# EasyEDA Pro project PixelGrid_Controller.eprj, schematic PixelGrid_Controller_v2
Board Name: PixelGrid_Controller_v2; Create Date: 2024-11-10; Page Name: Sheet_1; Project Name: PixelGrid_Controller; Schematic Name: PixelGrid_Controller_v2; Update Date: 2024-11-10; Add into BOM: yes; Company: Your Company; Convert to PCB: yes; Date: 2024-03-17; Draw By: Rimvydas Lazdauskas; REV: 1.0; Sheet: 1/1
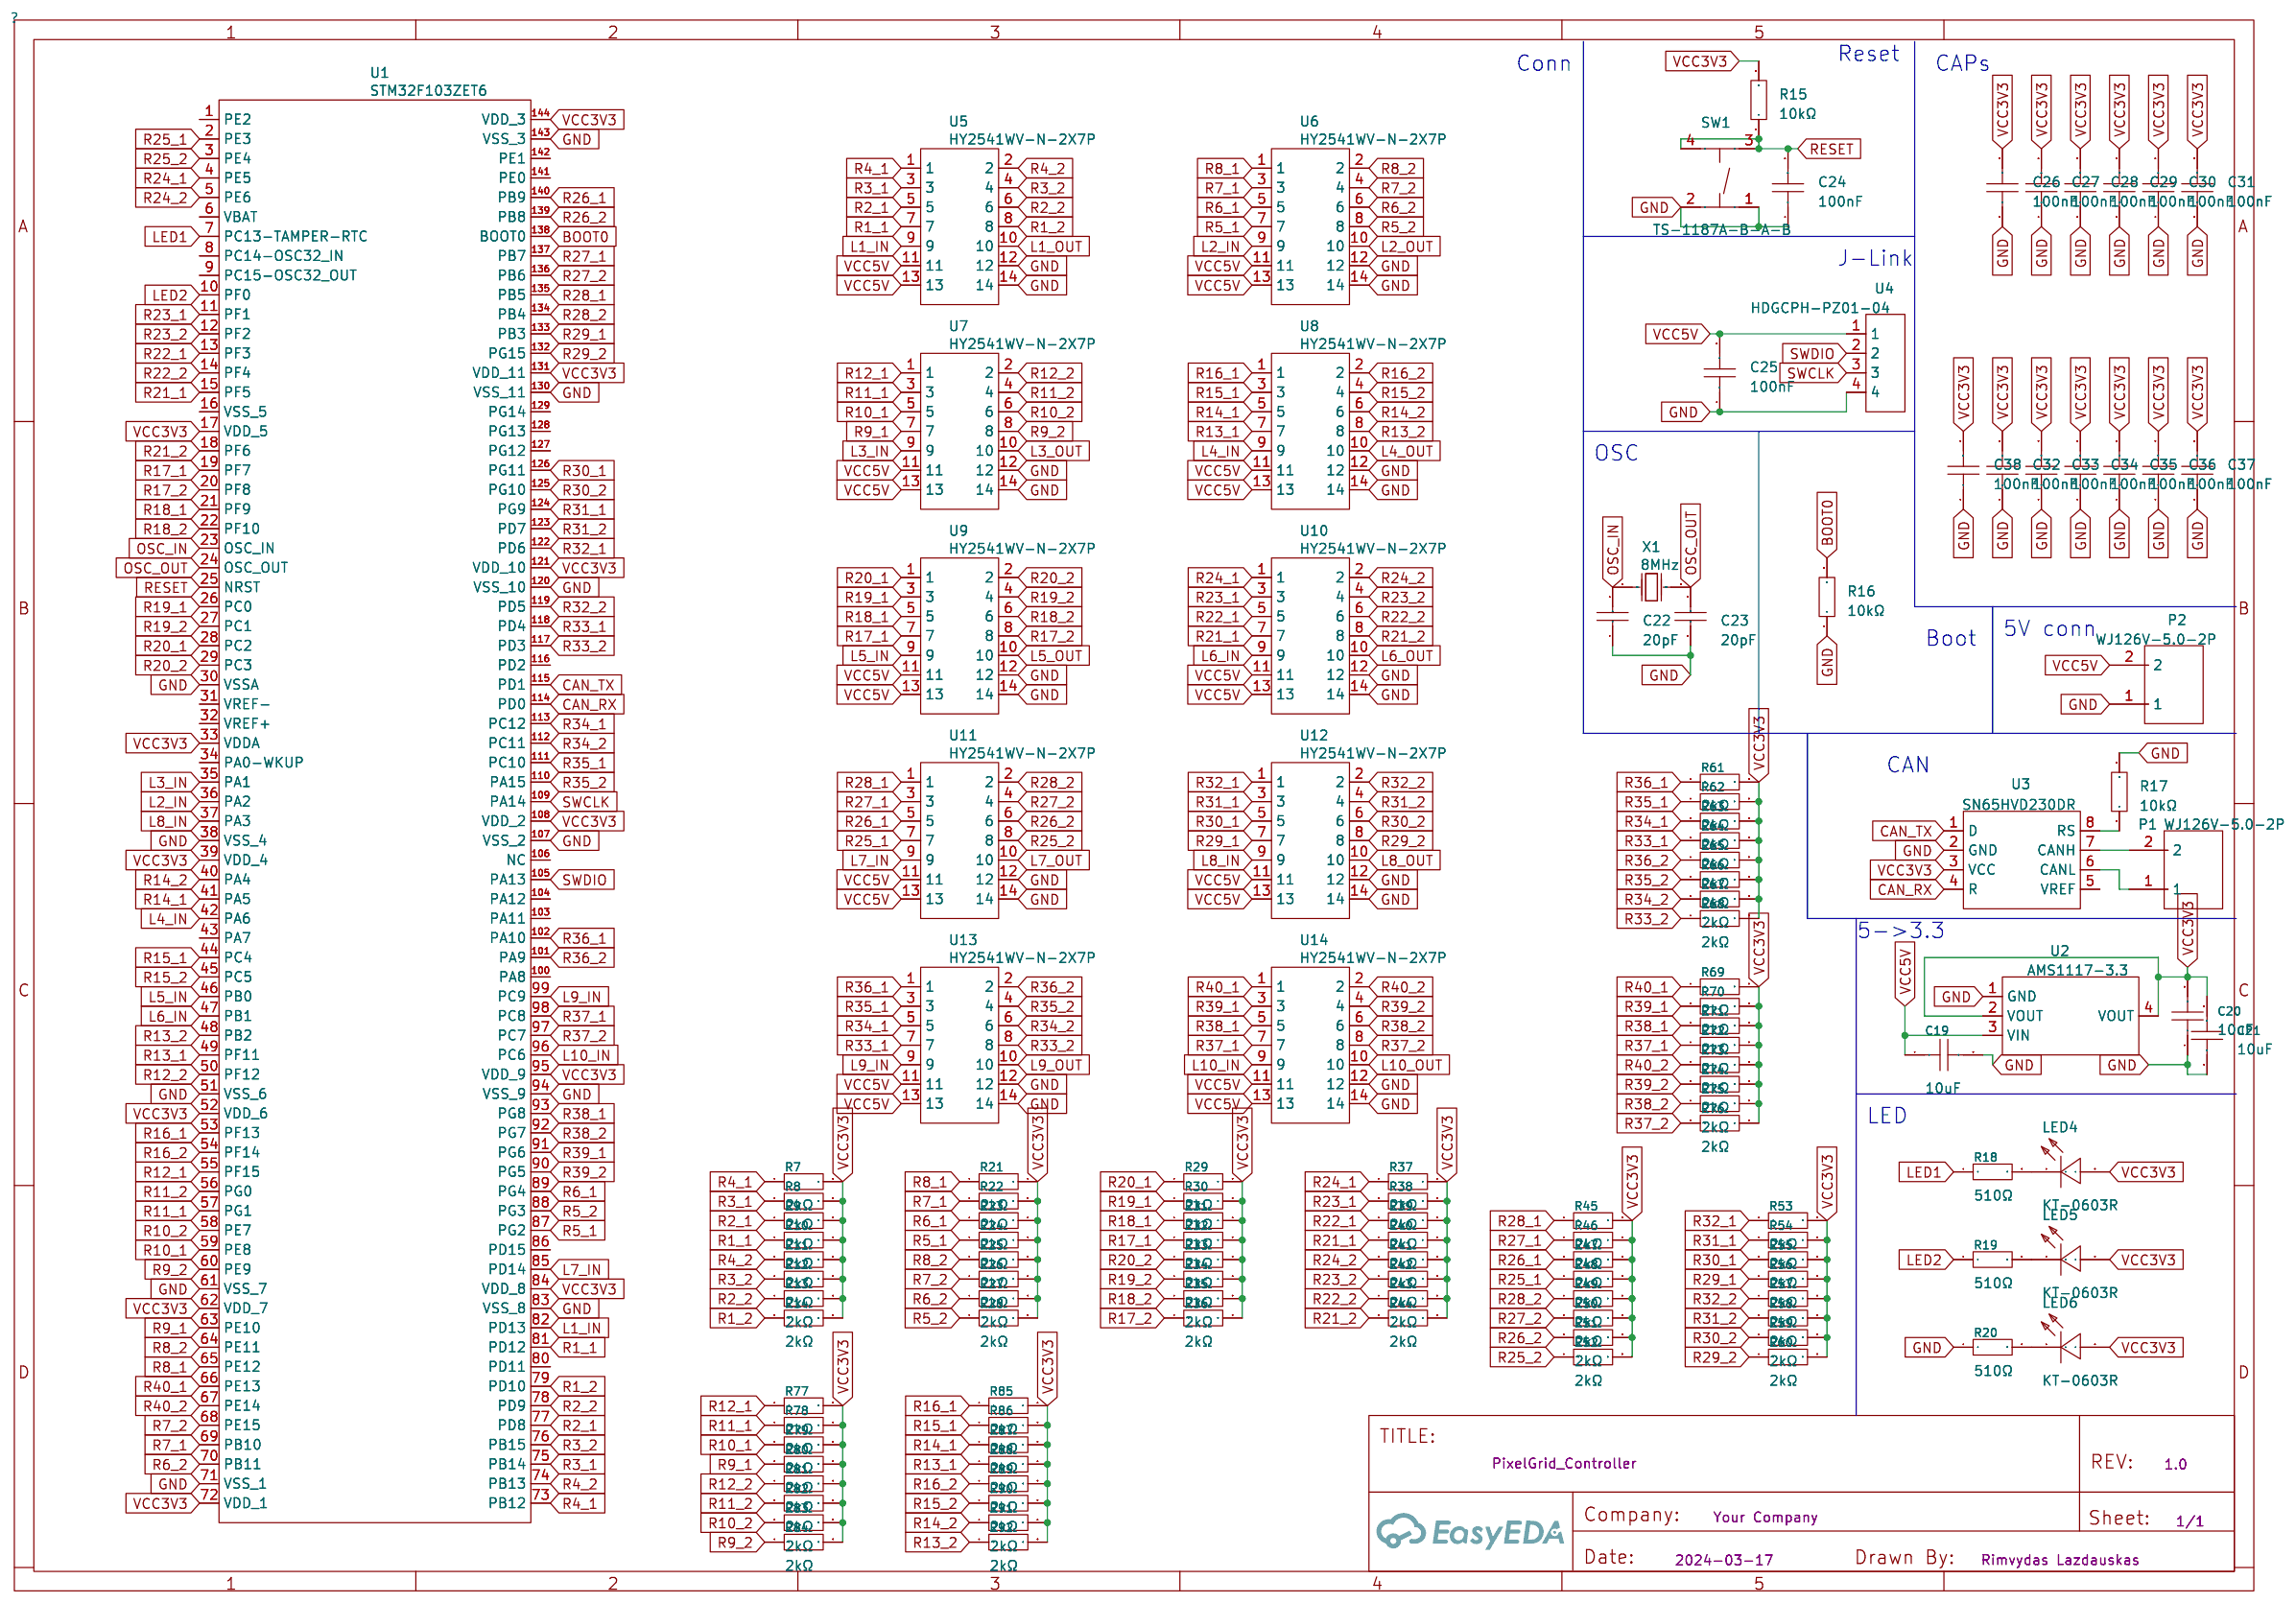
[diagram p0: schematic sheet]

## Parts
C19  10uF  [C0603]
C20  10uF  [C0603]
C21  10uF  [C0603]
C22  20pF  [C0402]
C23  20pF  [C0402]
C24  100nF  [C0402]
C25  100nF  [C0402]
C26  100nF  [C0402]
C27  100nF  [C0402]
C28  100nF  [C0402]
C29  100nF  [C0402]
C30  100nF  [C0402]
C31  100nF  [C0402]
C32  100nF  [C0402]
C33  100nF  [C0402]
C34  100nF  [C0402]
C35  100nF  [C0402]
C36  100nF  [C0402]
C37  100nF  [C0402]
C38  100nF  [C0402]
LED4  KT-0603R  [LED0603-RD]
LED5  KT-0603R  [LED0603-RD]
LED6  KT-0603R  [LED0603-RD]
P1  WJ126V-5.0-2P  [CONN-TH_WJ126V-5.0-2P]
P2  WJ126V-5.0-2P  [CONN-TH_WJ126V-5.0-2P]
R7  2kΩ  [R0402]
R8  2kΩ  [R0402]
R9  2kΩ  [R0402]
R10  2kΩ  [R0402]
R11  2kΩ  [R0402]
R12  2kΩ  [R0402]
R13  2kΩ  [R0402]
R14  2kΩ  [R0402]
R15  10kΩ  [R0402]
R16  10kΩ  [R0402]
R17  10kΩ  [R0402]
R18  510Ω  [R0402]
R19  510Ω  [R0402]
R20  510Ω  [R0402]
R21  2kΩ  [R0402]
R22  2kΩ  [R0402]
R23  2kΩ  [R0402]
R24  2kΩ  [R0402]
R25  2kΩ  [R0402]
R26  2kΩ  [R0402]
R27  2kΩ  [R0402]
R28  2kΩ  [R0402]
R29  2kΩ  [R0402]
R30  2kΩ  [R0402]
R31  2kΩ  [R0402]
R32  2kΩ  [R0402]
R33  2kΩ  [R0402]
R34  2kΩ  [R0402]
R35  2kΩ  [R0402]
R36  2kΩ  [R0402]
R37  2kΩ  [R0402]
R38  2kΩ  [R0402]
R39  2kΩ  [R0402]
R40  2kΩ  [R0402]
R41  2kΩ  [R0402]
R42  2kΩ  [R0402]
R43  2kΩ  [R0402]
R44  2kΩ  [R0402]
R45  2kΩ  [R0402]
R46  2kΩ  [R0402]
R47  2kΩ  [R0402]
R48  2kΩ  [R0402]
R49  2kΩ  [R0402]
R50  2kΩ  [R0402]
R51  2kΩ  [R0402]
R52  2kΩ  [R0402]
R53  2kΩ  [R0402]
R54  2kΩ  [R0402]
R55  2kΩ  [R0402]
R56  2kΩ  [R0402]
R57  2kΩ  [R0402]
R58  2kΩ  [R0402]
R59  2kΩ  [R0402]
R60  2kΩ  [R0402]
R61  2kΩ  [R0402]
R62  2kΩ  [R0402]
R63  2kΩ  [R0402]
R64  2kΩ  [R0402]
R65  2kΩ  [R0402]
R66  2kΩ  [R0402]
R67  2kΩ  [R0402]
R68  2kΩ  [R0402]
R69  2kΩ  [R0402]
R70  2kΩ  [R0402]
R71  2kΩ  [R0402]
R72  2kΩ  [R0402]
R73  2kΩ  [R0402]
R74  2kΩ  [R0402]
R75  2kΩ  [R0402]
R76  2kΩ  [R0402]
R77  2kΩ  [R0402]
R78  2kΩ  [R0402]
R79  2kΩ  [R0402]
R80  2kΩ  [R0402]
R81  2kΩ  [R0402]
R82  2kΩ  [R0402]
R83  2kΩ  [R0402]
R84  2kΩ  [R0402]
R85  2kΩ  [R0402]
R86  2kΩ  [R0402]
R87  2kΩ  [R0402]
R88  2kΩ  [R0402]
R89  2kΩ  [R0402]
R90  2kΩ  [R0402]
R91  2kΩ  [R0402]
R92  2kΩ  [R0402]
SW1  TS-1187A-B-A-B  [SW-SMD_4P-L5.1-W5.1-P3.70-LS6.5-TL-2]
U1  STM32F103ZET6  [LQFP-144_L20.0-W20.0-P0.50-LS22.0-BL]
U2  AMS1117-3.3  [SOT-223-3_L6.5-W3.4-P2.30-LS7.0-BR]
U3  SN65HVD230DR  [SOIC-8_L4.9-W3.9-P1.27-LS6.0-BL]
U4  HDGCPH-PZ01-04  [HDR-TH_4P-P2.54-V-M_1]  (no BOM)
U5  HY2541WV-N-2X7P  [HDR-TH_14P-P2.54-V-F-R2-C7-S2.54-2]
U6  HY2541WV-N-2X7P  [HDR-TH_14P-P2.54-V-F-R2-C7-S2.54-2]
U7  HY2541WV-N-2X7P  [HDR-TH_14P-P2.54-V-F-R2-C7-S2.54-2]
U8  HY2541WV-N-2X7P  [HDR-TH_14P-P2.54-V-F-R2-C7-S2.54-2]
U9  HY2541WV-N-2X7P  [HDR-TH_14P-P2.54-V-F-R2-C7-S2.54-2]
U10  HY2541WV-N-2X7P  [HDR-TH_14P-P2.54-V-F-R2-C7-S2.54-2]
U11  HY2541WV-N-2X7P  [HDR-TH_14P-P2.54-V-F-R2-C7-S2.54-2]
U12  HY2541WV-N-2X7P  [HDR-TH_14P-P2.54-V-F-R2-C7-S2.54-2]
U13  HY2541WV-N-2X7P  [HDR-TH_14P-P2.54-V-F-R2-C7-S2.54-2]
U14  HY2541WV-N-2X7P  [HDR-TH_14P-P2.54-V-F-R2-C7-S2.54-2]
X1  8MHz  [CRYSTAL-SMD_L5.0-W3.2]

## Library data of the parts
C19-C21 = CL10A106KP8NNNC: Capacitance: Tolerance:±10% Tolerance:±10% Voltage Rated: Temperature Coefficient:; LCSC Part Name: 10uF ±10% 10V; Supplier Part: C19702; Manufacturer: SAMSUNG(三星); Supplier Footprint: 0603; JLCPCB Part Class: Basic Part; Datasheet: https://atta.szlcsc.com/upload/public/pdf/source/20160218/1457707763339.pdf; Supplier: LCSC; Tolerance: ±10%
C22 C23 = 0402CG200J500NT: Capacitance: Tolerance:±5% Tolerance:±5% Voltage Rated: Temperature Coefficient:; LCSC Part Name: 20pF ±5% 50V; Supplier Part: C1554; Manufacturer: FH(风华); Supplier Footprint: 0402; JLCPCB Part Class: Basic Part; Datasheet: https://atta.szlcsc.com/upload/public/pdf/source/20200305/C486355_26A10D38EF8C2A5C37091D0039909270.pdf; Supplier: LCSC; Tolerance: ±5%
C24-C38 = CL05B104KO5NNNC: Capacitance: Tolerance:±10% Tolerance:±10% Voltage Rated: Temperature Coefficient:; LCSC Part Name: 100nF ±10% 16V; Supplier Part: C1525; Manufacturer: SAMSUNG(三星); Supplier Footprint: 0402; JLCPCB Part Class: Basic Part; Datasheet: https://atta.szlcsc.com/upload/public/pdf/source/20160218/1457707763339.pdf; Supplier: LCSC; Tolerance: ±10%
LED4-LED6 = KT-0603R: Emitted Color:Red Power Dissipation:- Forward Current:- Dominant Wavelength:- Dominant Wavelength:- Peak Wavelength:- Diode Configuration:- Lens Color:- Color Temperature:- Color Temperature:- Viewing Angle:- Mounting Sytle:- Operating Temperature:-40℃~+8; LCSC Part Name: 0603 红灯 高亮; Supplier Part: C2286; Manufacturer: KENTO; Supplier Footprint: 0603; JLCPCB Part Class: Basic Part; Datasheet: https://atta.szlcsc.com/upload/public/pdf/source/20160616/1466072038404.pdf; Supplier: LCSC; Emitted Color: Red; Operating Temperature: -40℃~+85℃
P1 P2 = WJ126V-5.0-2P: Supplier: LCSC; Manufacturer: KANGNEX(康奈克斯电气); Supplier Part: C8404; JLCPCB Part Class: Extended Part
R7-R14 R21-R92 = 0402WGF2001TCE: Type:Thick Film Resistors Resistance:2kΩ Tolerance:±1% Tolerance:±1% Power(Watts): Overload Voltage (Max): Temperature Coefficient:±100ppm/℃ Temperature Coefficient:±100ppm/℃ Operating Temperature Range:-55℃~+155℃ Operating Temperature Range:-55℃~+155℃; LCSC Part Name: 2kΩ ±1% 62.5mW 厚膜电阻; Supplier Part: C4109; Manufacturer: UNI-ROYAL(厚声); Supplier Footprint: 0402; JLCPCB Part Class: Basic Part; Datasheet: https://atta.szlcsc.com/upload/public/pdf/source/20200306/C422600_1E6D84923E4A46A82E41ADD87F860B5C.pdf; Supplier: LCSC; Type: Thick Film Resistors; Tolerance: ±1%; Temperature Coefficient: ±100ppm/℃; Operating Temperature Range: -55℃~+155℃
R15-R17 = 0402WGF1002TCE: Type:Thick Film Resistors Resistance:10kΩ Tolerance:±1% Tolerance:±1% Power(Watts): Overload Voltage (Max): Temperature Coefficient:±100ppm/℃ Temperature Coefficient:±100ppm/℃ Operating Temperature Range:-55℃~+155℃ Operating Temperature Range:-55℃~+155℃; LCSC Part Name: 10kΩ ±1% 62.5mW 厚膜电阻; Supplier Part: C25744; Manufacturer: UNI-ROYAL(厚声); Supplier Footprint: 0402; JLCPCB Part Class: Basic Part; Datasheet: https://atta.szlcsc.com/upload/public/pdf/source/20200306/C422600_1E6D84923E4A46A82E41ADD87F860B5C.pdf; Supplier: LCSC; Type: Thick Film Resistors; Tolerance: ±1%; Temperature Coefficient: ±100ppm/℃; Operating Temperature Range: -55℃~+155℃
R18-R20 = 0402WGF5100TCE: Type:Thick Film Resistors Resistance: Tolerance:±1% Tolerance:±1% Power(Watts): Overload Voltage (Max): Temperature Coefficient:±100ppm/℃ Temperature Coefficient:±100ppm/℃ Operating Temperature Range:-55℃~+155℃ Operating Temperature Range:-55℃~+155℃; LCSC Part Name: 510Ω ±1% 62.5mW 厚膜电阻; Supplier Part: C25123; Manufacturer: UNI-ROYAL(厚声); Supplier Footprint: 0402; JLCPCB Part Class: Basic Part; Datasheet: https://atta.szlcsc.com/upload/public/pdf/source/20200306/C422600_1E6D84923E4A46A82E41ADD87F860B5C.pdf; Supplier: LCSC; Type: Thick Film Resistors; Tolerance: ±1%; Temperature Coefficient: ±100ppm/℃; Operating Temperature Range: -55℃~+155℃
SW1 = TS-1187A-B-A-B: Supplier: LCSC; Supplier Part: C318884; Manufacturer: XKB Connectivity(中国星坤); JLCPCB Part Class: Basic Part
U1 = STM32F103ZET6: tags: STM32; Supplier Part: C8287; Supplier: LCSC; Manufacturer: ST(意法半导体); JLCPCB Part Class: Extended Part
U2 = AMS1117-3.3: Supplier: LCSC; Manufacturer: AMS; Supplier Part: C6186; JLCPCB Part Class: Basic Part
U3 = SN65HVD230DR: Supplier: LCSC; Manufacturer: TI(德州仪器); Supplier Part: C12084; JLCPCB Part Class: Extended Part
U4 = HDGCPH-PZ01-04: Supplier: LCSC; Supplier Part: C19190970; Manufacturer: HDGC(华德共创)
U5-U14 = HY2541WV-N-2X7P: Supplier: LCSC; Supplier Part: C17179454; Manufacturer: HanElectricity(瀚源); Manufacturer Part: HY2541WV-N-2x7P; JLCPCB Part Class: Extended Part
X1 = 8MHz: Supplier: LCSC; Manufacturer: YXC(扬兴晶振); Manufacturer Part: X50328MSB2GI; Supplier Part: C115962; JLCPCB Part Class: Basic Part

## Nets
GND: C19.2 C20.1 C21.1 C22.1 C23.1 C24.1 C25.1 C26.1 C27.1 C28.1 C29.1 C30.1 C31.1 C32.1 C33.1 C34.1 C35.1 C36.1 C37.1 C38.1 P2.1 R16.1 R17.2 R20.1 SW1.1(A) SW1.2(B) U1.30(VSSA) U1.38(VSS_4) U1.51(VSS_6) U1.61(VSS_7) U1.71(VSS_1) U1.83(VSS_8) U1.94(VSS_9) U1.107(VSS_2) U1.120(VSS_10) U1.130(VSS_11) U1.143(VSS_3) U2.1(GND) U3.2(GND) U4.4 U5.12 U5.14 U6.12 U6.14 U7.12 U7.14 U8.12 U8.14 U9.12 U9.14 U10.12 U10.14 U11.12 U11.14 U12.12 U12.14 U13.12 U13.14 U14.12 U14.14
VCC3V3: C20.2 C21.2 C26.2 C27.2 C28.2 C29.2 C30.2 C31.2 C32.2 C33.2 C34.2 C35.2 C36.2 C37.2 C38.2 LED4.2(A) LED5.2(A) LED6.2(A) R7.2 R8.2 R9.2 R10.2 R11.2 R12.2 R13.2 R14.2 R15.2 R21.2 R22.2 R23.2 R24.2 R25.2 R26.2 R27.2 R28.2 R29.2 R30.2 R31.2 R32.2 R33.2 R34.2 R35.2 R36.2 R37.2 R38.2 R39.2 R40.2 R41.2 R42.2 R43.2 R44.2 R45.2 R46.2 R47.2 R48.2 R49.2 R50.2 R51.2 R52.2 R53.2 R54.2 R55.2 R56.2 R57.2 R58.2 R59.2 R60.2 R61.2 R62.2 R63.2 R64.2 R65.2 R66.2 R67.2 R68.2 R69.2 R70.2 R71.2 R72.2 R73.2 R74.2 R75.2 R76.2 R77.2 R78.2 R79.2 R80.2 R81.2 R82.2 R83.2 R84.2 R85.2 R86.2 R87.2 R88.2 R89.2 R90.2 R91.2 R92.2 U1.17(VDD_5) U1.33(VDDA) U1.39(VDD_4) U1.52(VDD_6) U1.62(VDD_7) U1.72(VDD_1) U1.84(VDD_8) U1.95(VDD_9) U1.108(VDD_2) U1.121(VDD_10) U1.131(VDD_11) U1.144(VDD_3) U2.2(VOUT) U2.4(VOUT) U3.3(VCC)
VCC5V: C19.1 C25.2 P2.2 U2.3(VIN) U4.1 U5.11 U5.13 U6.11 U6.13 U7.11 U7.13 U8.11 U8.13 U9.11 U9.13 U10.11 U10.13 U11.11 U11.13 U12.11 U12.13 U13.11 U13.13 U14.11 U14.13
BOOT0: R16.2 U1.138(BOOT0)
CAN_RX: U1.114(PD0) U3.4(R)
CAN_TX: U1.115(PD1) U3.1(D)
L1_IN: U1.82(PD13) U5.9
L1_OUT: U5.10
L2_IN: U1.36(PA2) U6.9
L2_OUT: U6.10
L3_IN: U1.35(PA1) U7.9
L3_OUT: U7.10
L4_IN: U1.42(PA6) U8.9
L4_OUT: U8.10
L5_IN: U1.46(PB0) U9.9
L5_OUT: U9.10
L6_IN: U1.47(PB1) U10.9
L6_OUT: U10.10
L7_IN: U1.85(PD14) U11.9
L7_OUT: U11.10
L8_IN: U1.37(PA3) U12.9
L8_OUT: U12.10
L9_IN: U1.99(PC9) U13.9
L9_OUT: U13.10
L10_IN: U1.96(PC6) U14.9
L10_OUT: U14.10
LED1: R18.1 U1.7(PC13-TAMPER-RTC)
LED2: R19.1 U1.10(PF0)
OSC_IN: C22.2 U1.23(OSC_IN) X1.1(OSC1)
OSC_OUT: C23.2 U1.24(OSC_OUT) X1.2(OSC2)
R1_1: R10.1 U1.81(PD12) U5.7
R1_2: R14.1 U1.79(PD10) U5.8
R2_1: R9.1 U1.77(PD8) U5.5
R2_2: R13.1 U1.78(PD9) U5.6
R3_1: R8.1 U1.75(PB14) U5.3
R3_2: R12.1 U1.76(PB15) U5.4
R4_1: R7.1 U1.73(PB12) U5.1
R4_2: R11.1 U1.74(PB13) U5.2
R5_1: R24.1 U1.87(PG2) U6.7
R5_2: R28.1 U1.88(PG3) U6.8
R6_1: R23.1 U1.89(PG4) U6.5
R6_2: R27.1 U1.70(PB11) U6.6
R7_1: R22.1 U1.69(PB10) U6.3
R7_2: R26.1 U1.68(PE15) U6.4
R8_1: R21.1 U1.65(PE12) U6.1
R8_2: R25.1 U1.64(PE11) U6.2
R9_1: R80.1 U1.63(PE10) U7.7
R9_2: R84.1 U1.60(PE9) U7.8
R10_1: R79.1 U1.59(PE8) U7.5
R10_2: R83.1 U1.58(PE7) U7.6
R11_1: R78.1 U1.57(PG1) U7.3
R11_2: R82.1 U1.56(PG0) U7.4
R12_1: R77.1 U1.55(PF15) U7.1
R12_2: R81.1 U1.50(PF12) U7.2
R13_1: R88.1 U1.49(PF11) U8.7
R13_2: R92.1 U1.48(PB2) U8.8
R14_1: R87.1 U1.41(PA5) U8.5
R14_2: R91.1 U1.40(PA4) U8.6
R15_1: R86.1 U1.44(PC4) U8.3
R15_2: R90.1 U1.45(PC5) U8.4
R16_1: R85.1 U1.53(PF13) U8.1
R16_2: R89.1 U1.54(PF14) U8.2
R17_1: R32.1 U1.19(PF7) U9.7
R17_2: R36.1 U1.20(PF8) U9.8
R18_1: R31.1 U1.21(PF9) U9.5
R18_2: R35.1 U1.22(PF10) U9.6
R19_1: R30.1 U1.26(PC0) U9.3
R19_2: R34.1 U1.27(PC1) U9.4
R20_1: R29.1 U1.28(PC2) U9.1
R20_2: R33.1 U1.29(PC3) U9.2
R21_1: R40.1 U1.15(PF5) U10.7
R21_2: R44.1 U1.18(PF6) U10.8
R22_1: R39.1 U1.13(PF3) U10.5
R22_2: R43.1 U1.14(PF4) U10.6
R23_1: R38.1 U1.11(PF1) U10.3
R23_2: R42.1 U1.12(PF2) U10.4
R24_1: R37.1 U1.4(PE5) U10.1
R24_2: R41.1 U1.5(PE6) U10.2
R25_1: R48.1 U1.2(PE3) U11.7
R25_2: R52.1 U1.3(PE4) U11.8
R26_1: R47.1 U1.140(PB9) U11.5
R26_2: R51.1 U1.139(PB8) U11.6
R27_1: R46.1 U1.137(PB7) U11.3
R27_2: R50.1 U1.136(PB6) U11.4
R28_1: R45.1 U1.135(PB5) U11.1
R28_2: R49.1 U1.134(PB4) U11.2
R29_1: R56.1 U1.133(PB3) U12.7
R29_2: R60.1 U1.132(PG15) U12.8
R30_1: R55.1 U1.126(PG11) U12.5
R30_2: R59.1 U1.125(PG10) U12.6
R31_1: R54.1 U1.124(PG9) U12.3
R31_2: R58.1 U1.123(PD7) U12.4
R32_1: R53.1 U1.122(PD6) U12.1
R32_2: R57.1 U1.119(PD5) U12.2
R33_1: R64.1 U1.118(PD4) U13.7
R33_2: R68.1 U1.117(PD3) U13.8
R34_1: R63.1 U1.113(PC12) U13.5
R34_2: R67.1 U1.112(PC11) U13.6
R35_1: R62.1 U1.111(PC10) U13.3
R35_2: R66.1 U1.110(PA15) U13.4
R36_1: R61.1 U1.102(PA10) U13.1
R36_2: R65.1 U1.101(PA9) U13.2
R37_1: R72.1 U1.98(PC8) U14.7
R37_2: R76.1 U1.97(PC7) U14.8
R38_1: R71.1 U1.93(PG8) U14.5
R38_2: R75.1 U1.92(PG7) U14.6
R39_1: R70.1 U1.91(PG6) U14.3
R39_2: R74.1 U1.90(PG5) U14.4
R40_1: R69.1 U1.66(PE13) U14.1
R40_2: R73.1 U1.67(PE14) U14.2
RESET: C24.2 R15.1 SW1.3(C) SW1.4(D) U1.25(NRST)
SWCLK: U1.109(PA14) U4.3
SWDIO: U1.105(PA13) U4.2
$2N2: R17.1 U3.8(RS)
$2N4: P1.2 U3.7(CANH)
$2N5: P1.1 U3.6(CANL)
$2N12387: LED4.1(K) R18.2
$2N12392: LED5.1(K) R19.2
$2N12397: LED6.1(K) R20.2

Not connected (* = marked no-connect by the designer): U1 1(PE2) 6(VBAT) 8(PC14-OSC32_IN) 9(PC15-OSC32_OUT) 16(VSS_5) 31(VREF-) 32(VREF+) 34(PA0-WKUP) 43(PA7) 80(PD11) 86(PD15) 100(PA8) 103(PA11) 104(PA12) 106(NC) 116(PD2) 127(PG12) 128(PG13) 129(PG14) 141(PE0) 142(PE1); U3 5(VREF)

## Notes on the sheet
- Conn
- Reset
- CAPs
- J-Link
- OSC
- Boot
- 5V conn
- CAN
- 5->3.3
- LED
